# EAGLE design Grove - 3-Axis Digital Accelerometer(±400g) v1.0 (EAGLE 6.4)

## Sheet 1 of 2
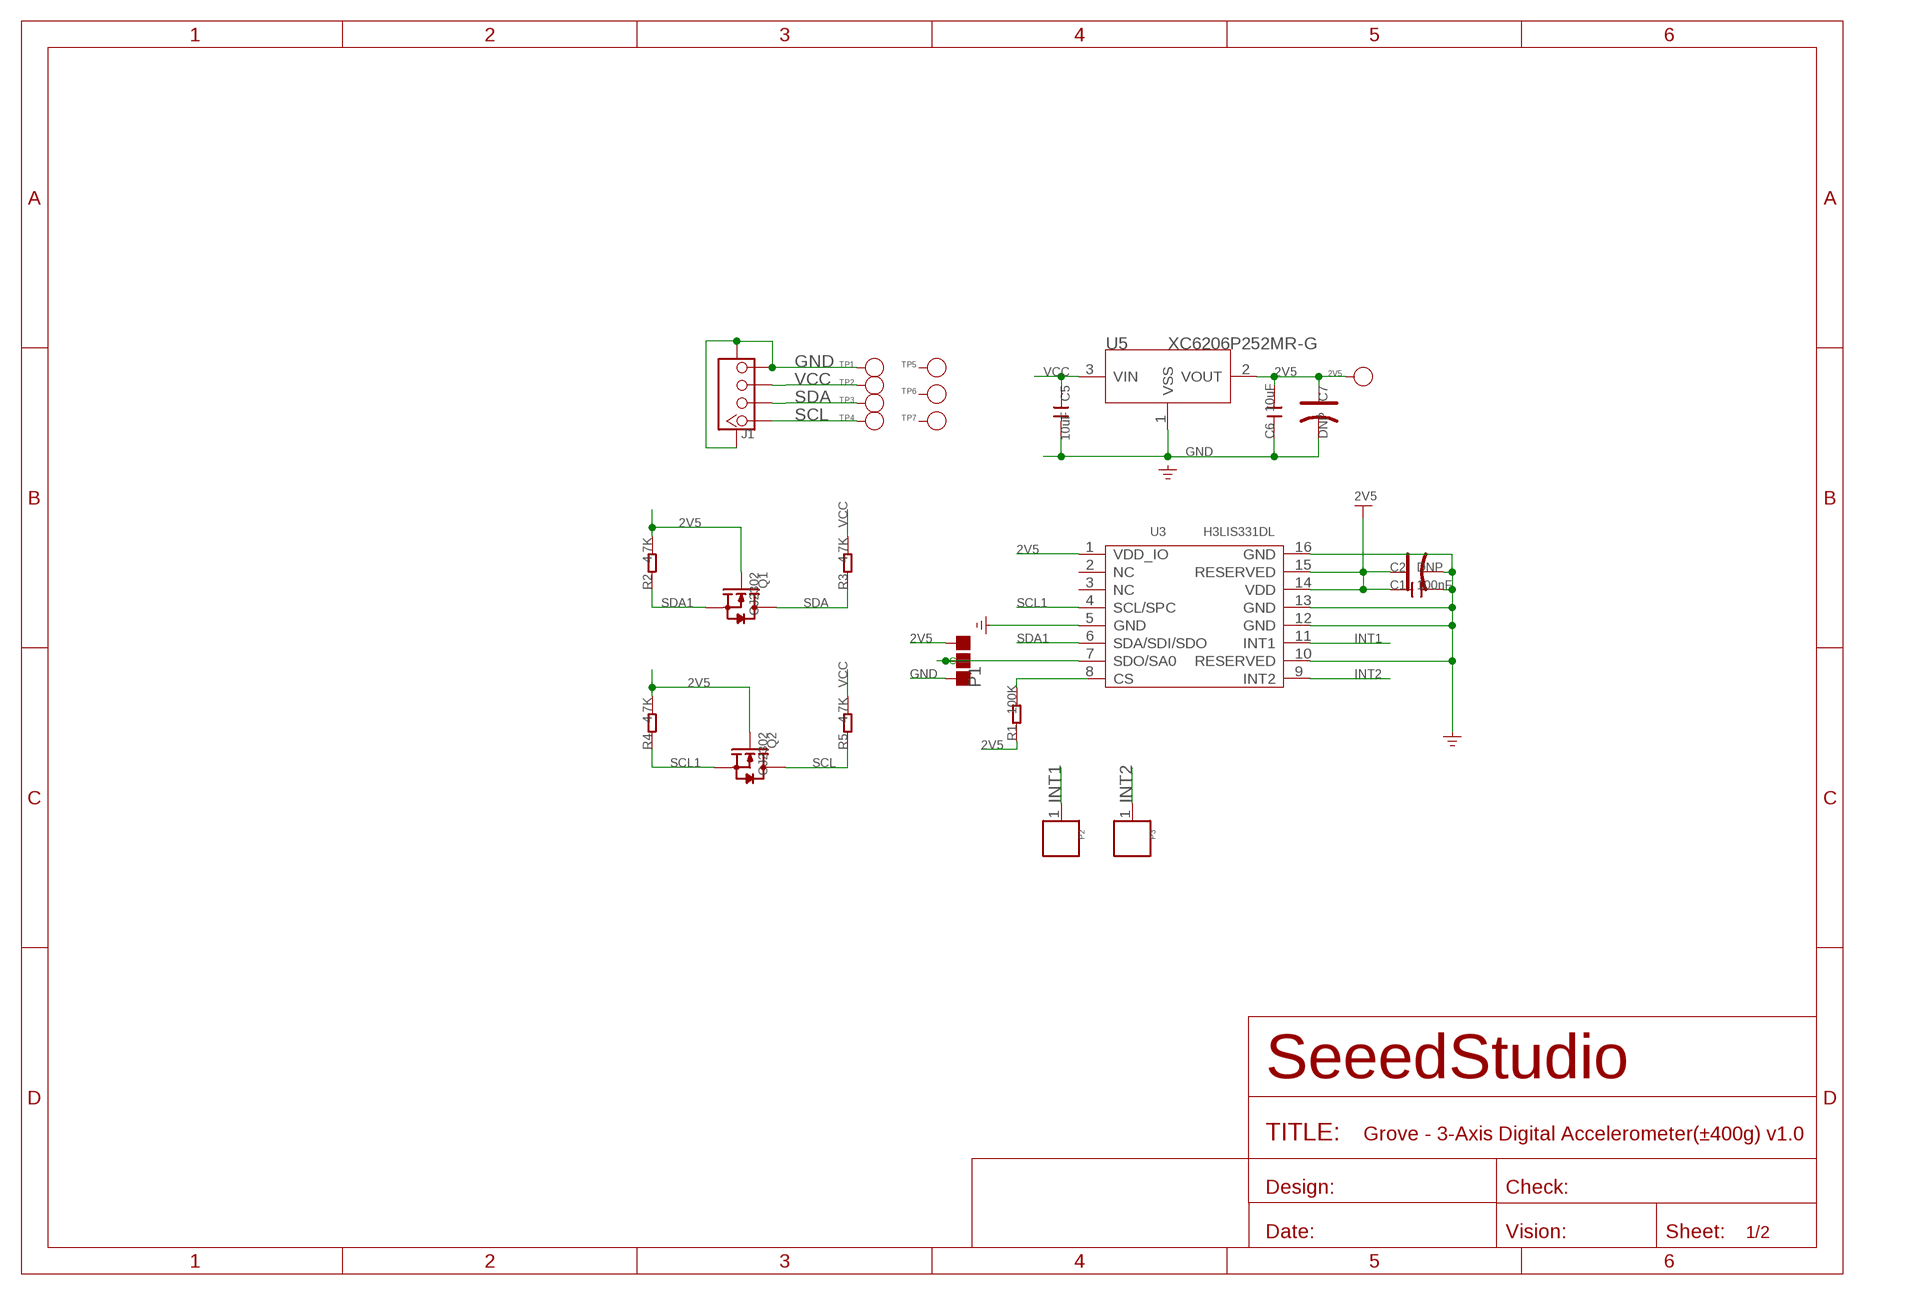
[diagram p0: schematic, sheet 1]

### Parts
2V5  PAD-TEST-POINT'4545'  [TP_4545]
C1  100nF  C-0603  [C0603]
C2  DNP  CAP-AVX-A  [AVX-A]
C5  10uF  C-0805  [C0805]
C6  10uF  C-0805  [C0805]
C7  DNP  CAP-AVX-A  [AVX-A]
J1  TWIG-4P-2.0-SMD-FEMALE-REINFORCE'DD'  [4P-SMD-2.0]
P1  PAD-JUMPER-3P-40*40  [3P-SMD-4.1X1.5]
P2  PAD'60/30'  [1P-65/35MIL]
P3  PAD'60/30'  [1P-65/35MIL]
Q1  CJ2302  MOSFET-N'SOT23'  [SOT23]
Q2  CJ2302  MOSFET-N'SOT23'  [SOT23]
R1  100K  R-0603  [R0603]
R2  4.7K  R-0603  [R0603]
R3  4.7K  R-0603  [R0603]
R4  4.7K  R-0603  [R0603]
R5  4.7K  R-0603  [R0603]
TP1  PAD-TEST-POINT'4545'  [TP_4545]
TP2  PAD-TEST-POINT'4545'  [TP_4545]
TP3  PAD-TEST-POINT'4545'  [TP_4545]
TP4  PAD-TEST-POINT'4545'  [TP_4545]
TP5  PAD-TEST-POINT'4545'  [TP_4545]
TP6  PAD-TEST-POINT'4545'  [TP_4545]
TP7  PAD-TEST-POINT'4545'  [TP_4545]
U3  H3LIS331DL  [TFLGA-16]
U5  XC6206P252MR-G  XC6206MR  [SOT23]

### Nets
2V5: 2V5.T C1.1 C2.+ C6.2 C7.+ P1.00(L) Q1.1(G) Q2.1(G) R1.1 R2.2 R4.2 U3.1(VDD_IO) U3.14(VDD) U3.15(RESERVED) U5.2(VOUT) ; supply symbol labelled POWER_BAR
GND: C1.2 C2.- C5.2 C6.1 C7.- J1.4 J1.SS1 J1.SS2 P1.11(R) TP1.T U3.5(GND) U3.10(RESERVED) U3.12(GND) U3.13(GND) U3.16(GND) U5.1(VSS)
INT1: P2.1 U3.11(INT1)
INT2: P3.1 U3.9(INT2)
N$2: R1.2
N$3: P1.MM(C) U3.7(SDO/SA0)
SCL: J1.1 Q2.3(D) R5.1 TP4.T
SCL1: Q2.2(S) R4.1 U3.4(SCL/SPC)
SDA: J1.2 Q1.3(D) R3.1 TP3.T
SDA1: Q1.2(S) R2.1 U3.6(SDA/SDI/SDO)
VCC: C5.1 J1.3 R3.2 R5.2 TP2.T U5.3(VIN)
Unconnected: TP5.T TP6.T TP7.T U3.2(NC) U3.3(NC) U3.8(CS)

## Sheet 2 of 2
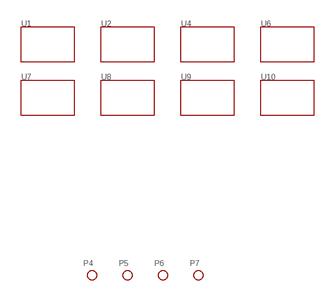
[diagram p1: schematic, sheet 2]

### Parts
P4  PAD-MARK  [ROUND-MARK-1.0]
P5  PAD-MARK  [ROUND-MARK-1.0]
P6  PAD-MARK  [ROUND-MARK-1.0]
P7  PAD-MARK  [ROUND-MARK-1.0]
U1  TWIG'2U'  [GROVE-TEST-PLATFORM]
U2  TWIG'2U'  [GROVE-TEST-PLATFORM]
U4  TWIG'2U'  [GROVE-TEST-PLATFORM]
U6  TWIG'2U'  [GROVE-TEST-PLATFORM]
U7  TWIG'2U'  [GROVE-TEST-PLATFORM]
U8  TWIG'2U'  [GROVE-TEST-PLATFORM]
U9  TWIG'2U'  [GROVE-TEST-PLATFORM]
U10  TWIG'2U'  [GROVE-TEST-PLATFORM]

## Library data of the parts
2V5 TP1-TP7 = Discrete:PAD-TEST-POINT; PARTNO: DNP
C1 C5 C6 = Discrete:C*: Ceramic Capacitors
C2 C7 = Discrete:CAP*: Electrolytic Capacitors,Tantalum Capacitors and Super Capacitors
J1 = Connector:TWIG-4P-2.0-SMD-FEMALE-REINFORCE
P1 = Discrete:PAD-JUMPER-3P; PARTNO: DNP
P2 P3 = Discrete:PAD
P4-P7 = Discrete:PAD-MARK; PARTNO: DNP
Q1 Q2 = Discrete:MOSFET-N: IRLL014: http://www.vishay.com/docs/91319/sihll014.pdf
R1-R5 = Discrete:R*
U1 U2 U4 U6-U10 = template:TWIG
U3 = template :H3LIS331DL: MEMS motion sensor with digital output, low power, high-g, 3-axis accelerometer
U5 = IC:XC6206: LOW ESR Cap.Compatible Positive Voltage Regulators

## Board
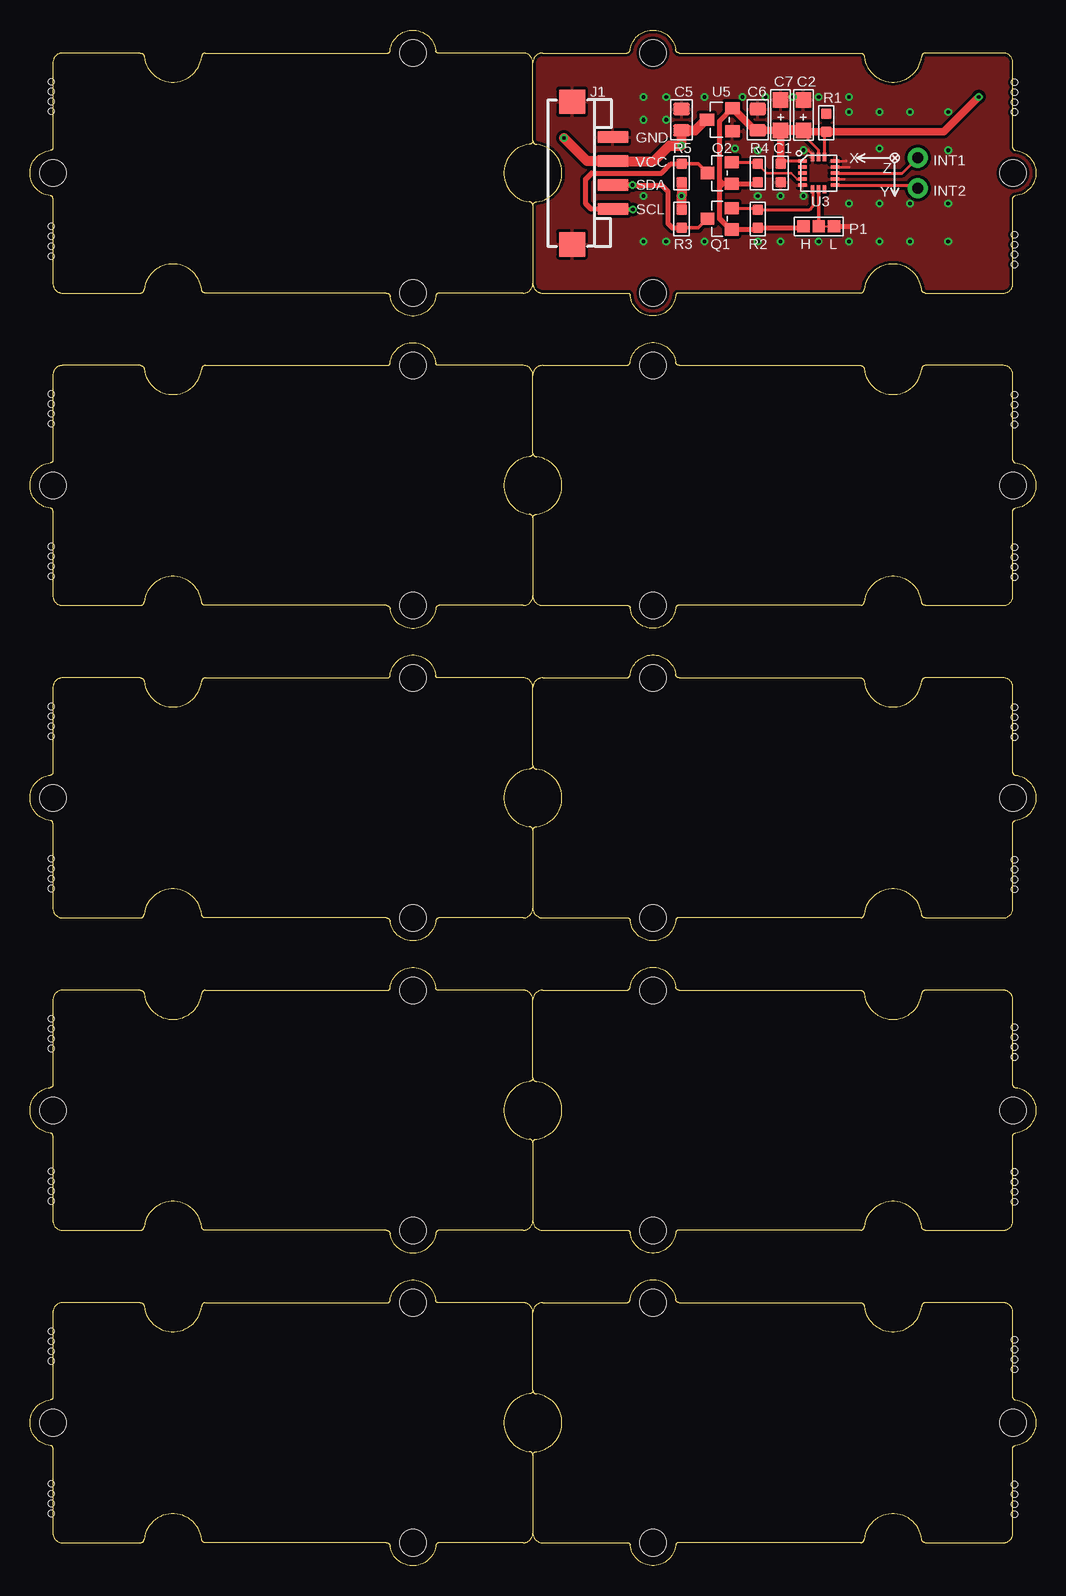
[diagram p2: board, top side]
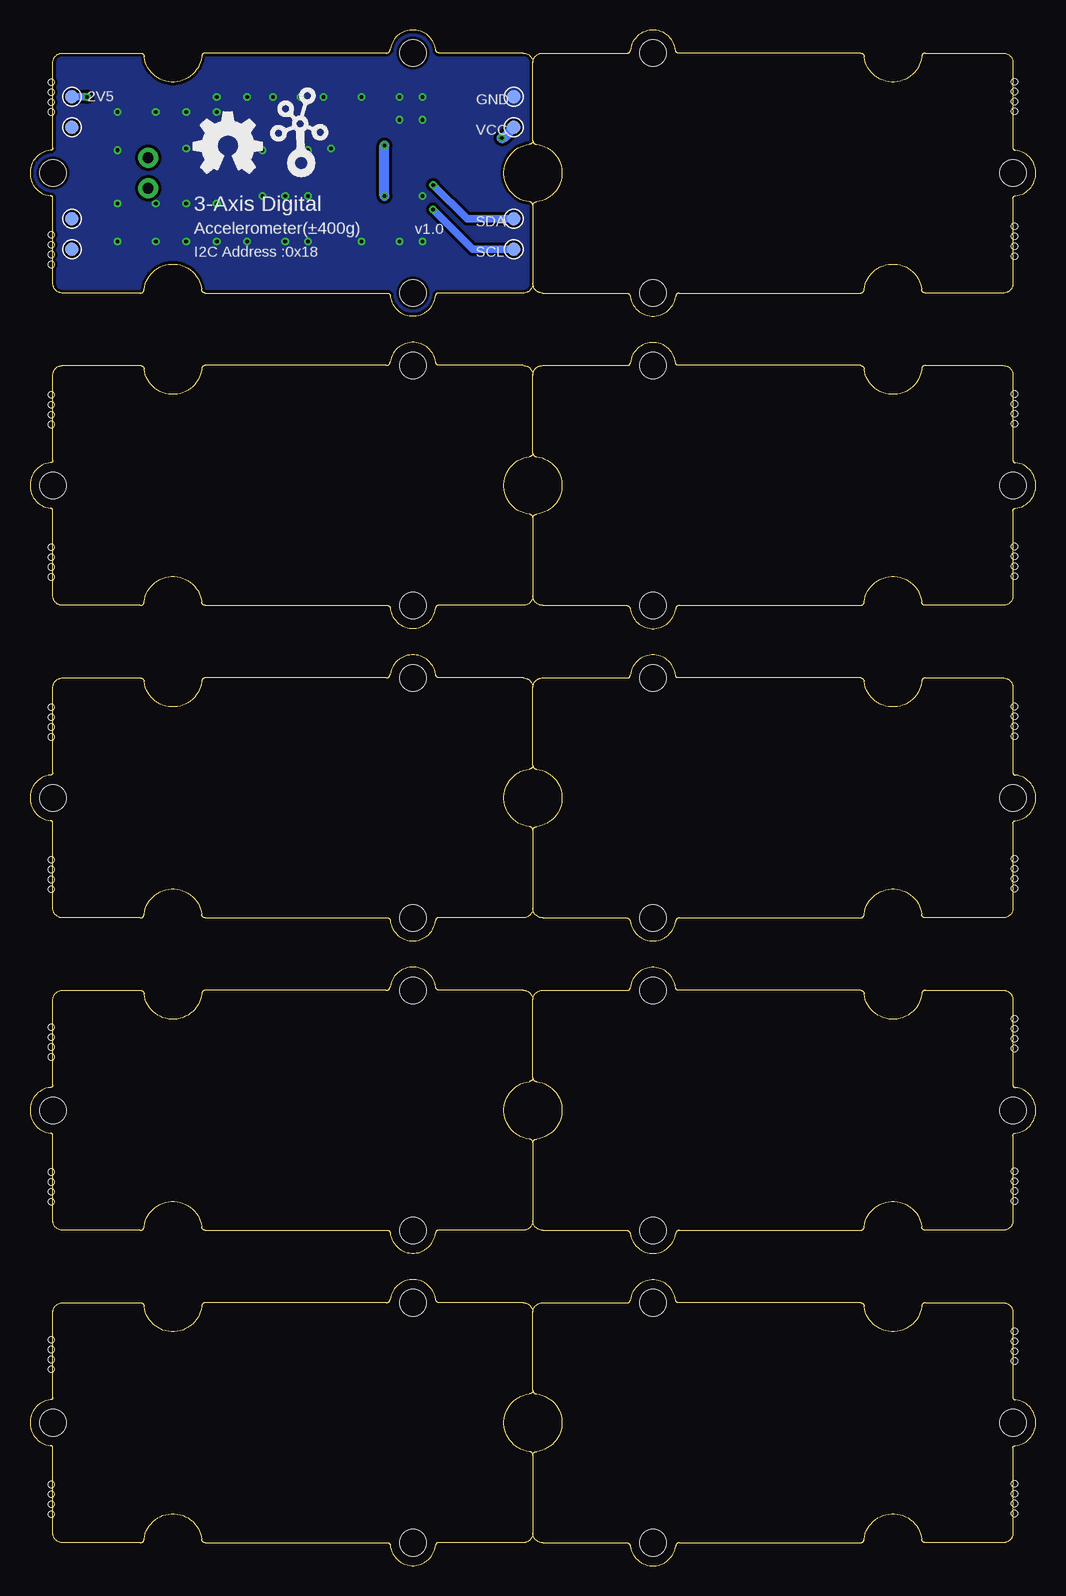
[diagram p3: board, bottom side, seen from below]

Size 83.82 x 127.98 mm. Coordinates in mm from the lower left corner, seen from the top.
Copper layers (1*16): Top 0.035mm / dielectric 1.5mm / Bottom 0.035mm
Design rules "SeeedStudio_rule_no_angle_090911 *": minimum track width 6mil, minimum drill 12mil, track to track 6mil, track to pad 6mil, pad to pad 6mil, via to via 6mil, smd to smd 0mil, copper to edge 10mil, drill to drill 10mil, minimum pad ring 10mil, minimum via ring 6mil, stop-mask expansion 2mil, vias tented up to drill 100mil, thermal gap 10mil
Holes 0.5 mm at 1.78,32.88 1.78,30.4 1.78,31.23 1.78,32.05 1.78,45.58 1.78,43.1 1.78,43.93 1.78,44.75 1.78,58.91 1.78,56.43 1.78,57.26 1.78,58.09 1.78,71.61 1.78,69.13 1.78,69.96 1.78,70.79 1.78,84.95 1.78,82.47 1.78,83.3 1.78,84.12 1.78,97.65 1.78,95.17 1.78,96 1.78,96.82 1.78,111.62 1.78,109.14 1.78,109.97 1.78,110.79 1.78,123.68 1.78,121.2 1.78,122.03 1.78,122.86 82.04,121.14 82.04,123.62 82.04,122.79 82.04,121.97 82.04,108.44 82.04,110.92 82.04,110.09 82.04,109.27 82.04,95.11 82.04,97.58 82.04,96.76 82.04,95.93 82.04,82.41 82.04,84.88 82.04,84.06 82.04,83.23 82.04,69.07 82.04,71.55 82.04,70.72 82.04,69.9 82.04,56.37 82.04,58.85 82.04,58.02 82.04,57.2 82.04,42.4 82.04,44.88 82.04,44.05 82.04,43.23 82.04,30.34 82.04,32.81 82.04,31.99 82.04,31.16 1.78,6.84 1.78,4.36 1.78,5.19 1.78,6.02 1.78,19.54 1.78,17.06 1.78,17.89 1.78,18.72 82.04,16.37 82.04,18.84 82.04,18.02 82.04,17.19 82.04,4.3 82.04,6.78 82.04,5.95 82.04,5.13
Holes 1.91 mm at -4.13,2.4 87.95,2.4 87.95,125.59 -4.13,125.59
tRestrict: area 66.9,116.7 to 67.2,116.8

### Footprints (pad centres in the part's own frame; a part is rotated, then mirrored left to right if it is on the bottom)
TP_4545 = smd 1.143 x 1.143: T 0,0
C0603 = smd 0.889 x 0.889: 1 -0.762,0; 2 0.762,0
AVX-A = smd 1.27 x 1.27: + -1.27,0; - 1.27,0
C0805 = smd 1.016 x 1.397: 1 -0.889,0; 2 0.889,0
4P-SMD-2.0 = smd 0.965 x 2.54: 1 -3,0; 2 -1,0; 3 1,0; 4 3,0 | smd 2.032 x 2.184: SS1 -5.946,3.4; SS2 5.946,3.4
3P-SMD-4.1X1.5 = smd 1.016 x 1.016: 00 -1.27,0; 11 1.27,0; MM 0,0
1P-65/35MIL = drill 0.889 pad 1.651: 1 0,0
ROUND-MARK-1.0 = smd 1.016 x 1.016: P$1 0,0
SOT23 = smd 1.016 x 1.143: 1 -0.889,-1.016; 2 0.889,-1.016; 3 0,1.016
R0603 = smd 0.889 x 0.889: 1 -0.762,0; 2 0.762,0
GROVE-TEST-PLATFORM = hole 2.2: -10,-10; -10,10; 20,0
TFLGA-16 = smd 0.7 x 0.3: 1 -1.35,1; 2 -1.35,0.5; 3 -1.35,0; 4 -1.35,-0.5; 5 -1.35,-1; 9 1.35,-1; 10 1.35,-0.5; 11 1.35,0; 12 1.35,0.5; 13 1.35,1 | smd 0.3 x 0.7: 6 -0.5,-1.35; 7 0,-1.35; 8 0.5,-1.35; 14 0.5,1.35; 15 0,1.35; 16 -0.5,1.35
SOT23' = smd 1.016 x 1.2: 1 -0.95,-1.06; 2 0.95,-1.06; 3 0,1.06

### Placement (x,y rotation side)
2V5  80.33,122.41 0 bottom
C1  62.55,116.06 270 top
C2  64.45,120.89 90 top
C5  54.29,120.51 90 top
C6  60.64,120.51 270 top
C7  62.55,120.89 90 top
J1  48.58,116.06 90 top
P1  65.72,111.62 0 top
P2  73.98,117.33 270 top
P3  73.98,114.79 270 top
P4  -4.13,7.48 0 top  (outside the outline)
P5  87.95,7.48 0 top  (outside the outline)
P6  -4.13,120.51 0 top  (outside the outline)
P7  87.95,120.51 0 top  (outside the outline)
Q1  57.47,112.25 90 top
Q2  57.47,116.06 90 top
R1  66.36,120.25 90 top
R2  60.64,112.25 270 top
R3  54.29,112.25 90 top
R4  60.64,116.06 270 top
R5  54.29,116.06 270 top
TP1  43.5,122.41 0 bottom
TP2  43.5,119.87 0 bottom
TP3  43.5,112.25 0 bottom
TP4  43.5,109.71 0 bottom
TP5  80.33,119.87 0 bottom
TP6  80.33,112.25 0 bottom
TP7  80.33,109.71 0 bottom
U1  61.91,37.96 0 top
U2  21.91,37.96 180 top
U3  65.72,116.06 0 top
U4  61.91,63.99 0 top
U5  XC6206P252MR-G  [SOT23']  57.47,120.51 90 top
U6  21.91,63.99 180 top
U7  61.91,90.03 0 top
U8  21.91,90.03 180 top
U9  21.91,116.06 180 top
U10  61.91,116.06 0 top
U11  [GROVE-TEST-PLATFORM]  61.91,11.92 0 top
U12  [GROVE-TEST-PLATFORM]  21.91,11.92 180 top
U$1  [OSHW_FILLX200_NOTEXT]  70.17,116.06 0 bottom
U$3  [TWIGLOGO]  61.28,116.7 0 bottom

### Tracks (layer width: path | path; a pad name or v marks a point on that pad's centre or on a via)
2V5  (via drill 0.3 pad 0.64)
  Top 0.254: U3.14 66.22,119.36 R1.1 | U3.1 62.66,117.06 62.55,116.95 | U3.15 65.72,117.97 64.83,118.86 64.83,119.49
  Top 0.406: 57.47,114.92 57.47,112.25 58.36,111.36 Q1.1 60.52,111.36 R2.2 64.33,111.49 P1.00 | 57.47,114.92 57.47,115.43 | 57.47,115.43 57.47,120.4 U5.2 | R4.2 60.52,115.17 Q2.1 57.72,115.17 | 57.72,115.17 57.47,115.43 | 57.72,115.17 57.47,114.92
  Top 0.61: C1.1 62.55,116.95 C7.+ C6.2 60.52,119.74 60.26,119.74 58.55,121.46 U5.2 | 64.58,119.49 64.83,119.49 R1.1 76.14,119.49 v79.06,122.41
  Top 0.813: 64.58,119.49 C2.+ C7.+
  Bottom 0.61: v79.06,122.41 2V5.T
GND  (via drill 0.3 pad 0.64)
  Top 0.203: U3.12 68.26,116.56 | U3.10 67.87,115.56 | U3.13 68.01,117.06 68.01,117.08
  Top 0.254: v64.45,117.97 64.83,117.97 65.22,117.59 U3.16
  Top 0.406: P1.11 68.26,111.62
  other vias: 62.55,114.16 64.45,114.16 60.64,114.16 60.64,117.97 58.74,118.09 61.28,122.41 56.2,122.41 65.72,122.41 68.26,121.14 70.8,121.14 73.34,121.14 76.52,121.14 70.8,118.09 76.52,117.97 68.26,113.52 70.8,113.52 76.52,113.52 51.12,122.41 51.12,120.51 53.02,122.41 53.02,120.51 59.37,122.41 63.56,122.41 68.26,122.41 73.34,113.52 51.12,114.16 51.12,110.35 53.02,110.35 56.2,110.35 60.64,110.35 62.55,110.35 65.72,110.35 68.26,110.35 70.8,110.35 73.34,110.35 76.52,110.35
  pour Bottom (isolate 0.254): 41.59,128.13 84.9,128.13 84.9,104 41.59,104
  pour Top (isolate 0.254): 41.59,128.13 84.9,128.13 84.9,104 41.59,104
INT1
  Top 0.254: U3.11 72.71,116.06 P2.1
INT2
  Top 0.254: U3.9 73.71,115.06 P3.1
N$3
  Top 0.152: P1.MM 66.61,111.62
  Top 0.305: U3.7 P1.MM
SCL  (via drill 0.3 pad 0.64)
  Top 0.305: R5.1 55.69,116.82 Q2.3
  Top 0.406: R5.1 53.4,116.82 52.64,116.06 46.8,116.06 46.29,115.55 46.29,113.52 46.75,113.06 J1.1 48.63,113.01 v50.23,113.01
  Bottom 0.61: TP4.T 46.93,109.71 v50.23,113.01
SCL1
  Top 0.203: R4.1 61.41,116.06 63.44,116.06 63.94,115.56 U3.4
  Top 0.254: Q2.2 60.52,116.95 R4.1
SDA  (via drill 0.3 pad 0.64)
  Top 0.305: R3.1 55.69,111.49 Q1.3
  Top 0.406: R3.1 53.53,111.49 53.15,111.87 53.15,114.54 52.63,115.06 v50.21,115.06 J1.2
  Bottom 0.61: TP3.T 47.4,112.25 v50.21,115.06
SDA1
  Top 0.254: Q1.2 60.52,113.14 R2.1 64.96,113.01 65.22,113.28 U3.6
VCC  (via drill 0.3 pad 0.64)
  Top 0.813: v44.51,118.98 46.44,117.06 J1.3 51.99,117.06 53.28,118.35 v54.29,118.35 54.29,119.49 54.42,119.62 | U5.3 56.33,120.51 55.44,119.62 54.42,119.62 | C5.1 54.42,119.62 | R3.2 v54.29,114.16 R5.2
  Bottom 0.813: v44.51,118.98 44.39,118.98 TP2.T | v54.29,114.16 v54.29,118.35

### Text on the board
tPlace: GND | VCC | SDA | SCL | H | L
bPlace: GND | VCC | 3-Axis Digital | SDA | v1.0 | Accelerometer(±400g) | SCL | I2C Address :0x18
tNames: X | INT1 | Z | Y | INT2